# Altium schematic sheet sch.SchDoc
size A4
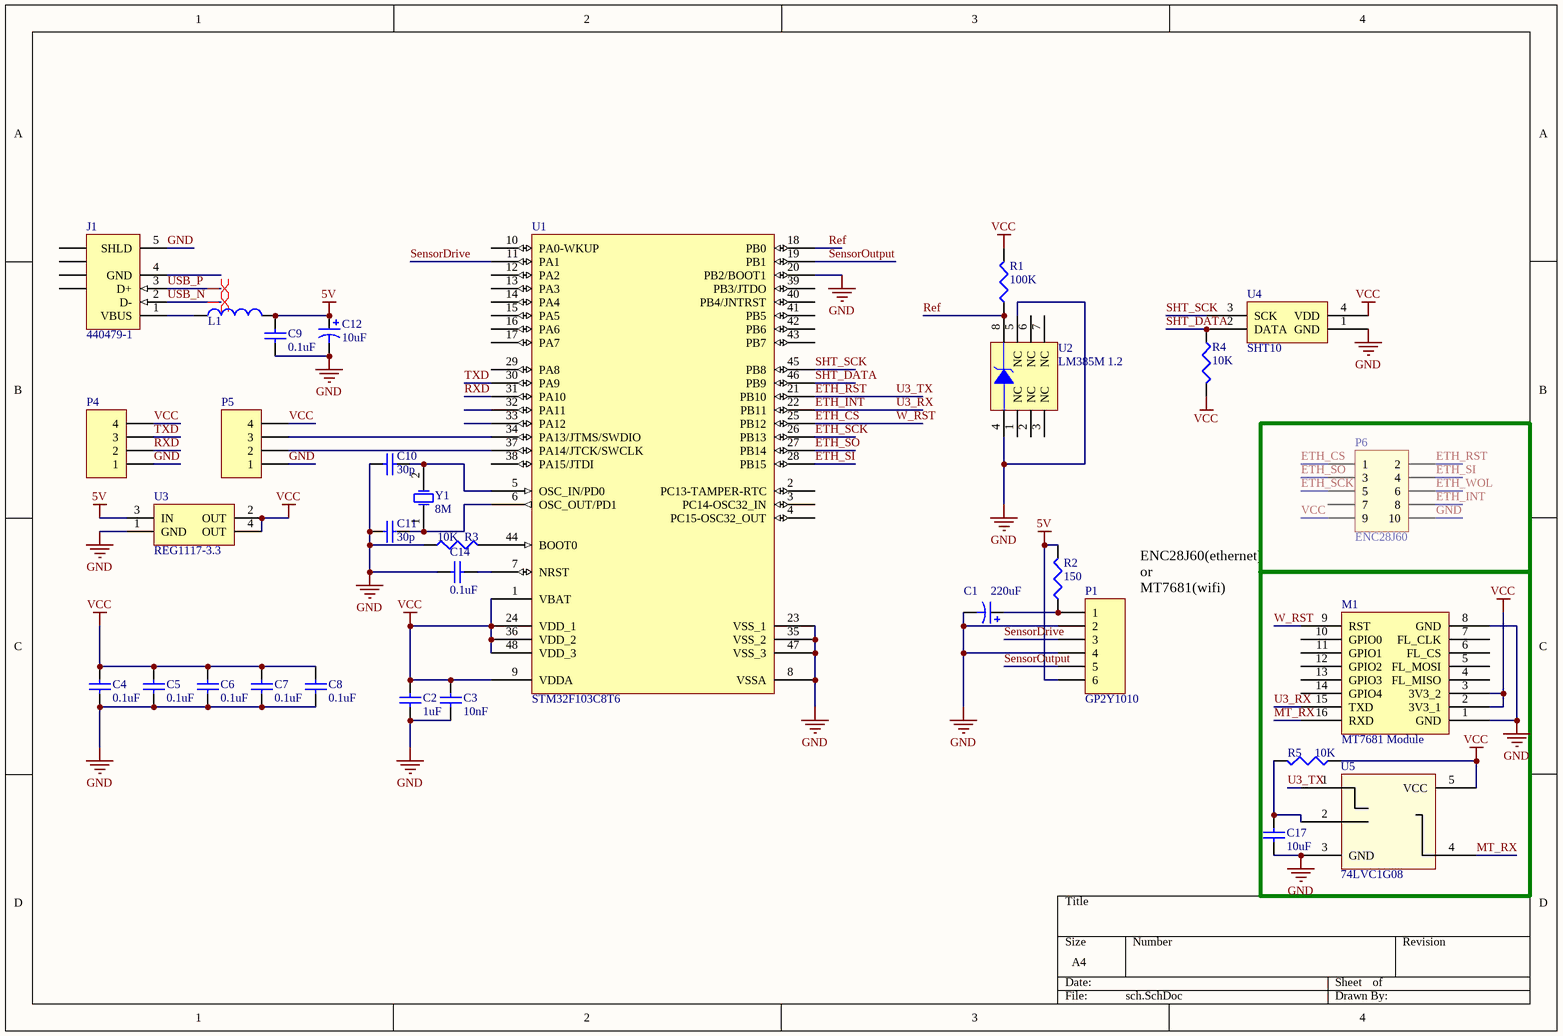
[diagram p0: sch.SchDoc]

## Parts
C1  value 220uF  [B]  (hidden comment: Cap Pol1)
C2  value 1uF  [C1206]  (hidden comment: Cap Semi)
C3  value 10nF  [C1206]  (hidden comment: Cap Semi)
C4  value 0.1uF  [C1206]  (hidden comment: Cap Semi)
C5  value 0.1uF  [C1206]  (hidden comment: Cap Semi)
C6  value 0.1uF  [C1206]  (hidden comment: Cap Semi)
C7  value 0.1uF  [C1206]  (hidden comment: Cap Semi)
C8  value 0.1uF  [C1206]  (hidden comment: Cap Semi)
C9  value 0.1uF  [C1206]  (hidden comment: Cap Semi)
C10  value 30p  [C1206]  (hidden comment: Cap Semi)
C11  value 30p  [C1206]  (hidden comment: Cap Semi)
C12  value 10uF  [1812]  (hidden comment: Cap Pol3)
C14  value 0.1uF  [C1206]  (hidden comment: Cap Semi)
C17  value 10uF  [C1206]  (hidden comment: Cap Semi)
J1  440479-1  [440479]
L1  Inductor  [2012_Chip]  (value not drawn)
M1  MT7681 Module
P1  GP2Y1010  [GP2Y1010AU0F]
P4  Header 4  [HDR1X4]  (value not drawn)
P5  Header 4  [HDR1X4]  (value not drawn)
P6  ENC28J60  [ENC28J60Board]
R1  value 100K  [2012[0805]]  (hidden comment: Res3)
R2  value 150  [2012[0805]]  (hidden comment: Res3)
R3  value 10K  [2012[0805]]  (hidden comment: Res3)
R4  value 10K  [2012[0805]]  (hidden comment: Res3)
R5  value 10K  [2012[0805]]  (hidden comment: Res3)
U1  STM32F103C8T6  [LQFP48_N]
U2  LM385M 1.2  [D008_N]
U3  REG1117-3.3  [ZZ311]
U4  SHT10  [SOIC127P600-8N]
U5  74LVC1G08
Y1  8M  [BCY-W2/E4.7]

## Nets
5V: C9.2 C12.1 L1.2 P1.6 R2.2 U3.3(IN)
GND: C1.2 C2.1 C3.1 C4.1 C5.1 C6.1 C7.1 C8.1 C9.1 C10.2 C11.2 C12.2 C14.2 C17.1 J1.5(SHLD) M1.1(GND) M1.8(GND) P1.2 P1.4 P4.1 P5.1 P6.10 R3.1 U1.8(VSSA) U1.20(PB2/BOOT1) U1.23(VSS_1) U1.35(VSS_2) U1.47(VSS_3) U2.4(A) U2.5(NC) U3.1(GND) U4.1(GND) U5.3(GND)
VCC: C2.2 C3.2 C4.2 C5.2 C6.2 C7.2 C8.2 M1.2(3V3_1) M1.3(3V3_2) P4.4 P5.4 P6.9 R1.2 R4.2 R5.1 U1.1(VBAT) U1.9(VDDA) U1.24(VDD_1) U1.36(VDD_2) U1.48(VDD_3) U3.2(OUT) U3.4(OUT) U4.4(VDD) U5.5(VCC)
ETH_CS: M1.9(RST) P6.1 U1.25(PB12)  [also labelled W_RST]
ETH_INT: M1.15(TXD) P6.8 U1.22(PB11)  [also labelled U3_RX]
ETH_RST: P6.2 U1.21(PB10) U5.1(B)  [also labelled U3_TX]
ETH_SCK: P6.5 U1.26(PB13)
ETH_SI: P6.4 U1.28(PB15)
ETH_SO: P6.3 U1.27(PB14)
ETH_WOL: P6.6
MT_RX: M1.16(RXD) U5.4(Y)
Ref: R1.1 U1.18(PB0) U2.8(K)
RXD: P4.2 U1.31(PA10)
SensorDrive: P1.3 U1.11(PA1)
SensorOutput: P1.5 U1.19(PB1)
SHT_DATA: R4.1 U1.46(PB9) U4.2(DATA)
SHT_SCK: U1.45(PB8) U4.3(SCK)
TXD: P4.3 U1.30(PA9)
USB_N: J1.2(D-)
USB_P: J1.3(D+)
NetC1_1: C1.1 P1.1 R2.1
NetC10_1: C10.1 U1.5(OSC_IN/PD0) Y1.2(OSC2)
NetC11_1: C11.1 U1.6(OSC_OUT/PD1) Y1.1(OSC1)
NetC14_1: C14.1 U1.7(NRST)
NetC17_2: C17.2 R5.2 U5.2(A)
NetJ1_1: J1.1(VBUS) L1.1
NetP5_2: P5.2 U1.37(PA14/JTCK/SWCLK)
NetP5_3: P5.3 U1.34(PA13/JTMS/SWDIO)
NetR3_2: R3.2 U1.44(BOOT0)

Not connected (* = marked no-connect by the designer): J1 4(GND) 6(SHLD) 7(SHLD) 8(SHLD) 9(SHLD); M1 4(FL_MISO) 5(FL_MOSI) 6(FL_CS) 7(FL_CLK) 10(GPIO0) 11(GPIO1) 12(GPIO2) 13(GPIO3) 14(GPIO4); P6 7; U1 2(PC13-TAMPER-RTC) 3(PC14-OSC32_IN) 4(PC15-OSC32_OUT) 10(PA0-WKUP) 12(PA2) 13(PA3) 14(PA4) 15(PA5) 16(PA6) 17(PA7) 29(PA8) 32(PA11) 33(PA12) 38(PA15/JTDI) 39(PB3/JTDO) 40(PB4/JNTRST) 41(PB5) 42(PB6) 43(PB7); U2 1(NC) 2(NC) 3(NC) 6(NC) 7(NC)

## Layout directives
differential pair: USB_N, USB_P

## Notes on the sheet
- ENC28J60(ethernet)
  or
  MT7681(wifi)

## Library data of the parts
C1 = Cap Pol1: Polarized Capacitor (Radial); Published: 8-Jun-2000; LatestRevisionDate: 17-Jul-2002; LatestRevisionNote: Re-released for DXP Platform.; PackageReference: RB7.6-15; Publisher: Altium Limited
C2-C11 C14 C17 = Cap Semi: Capacitor (Semiconductor SIM Model); Published: 8-Jun-2000; LatestRevisionDate: 17-Jul-2002; LatestRevisionNote: Re-released for DXP Platform.; PackageReference: C1206; Publisher: Altium Limited
C12 = Cap Pol3: Polarized Capacitor (Surface Mount); Published: 8-Jun-2000; LatestRevisionDate: 17-Jul-2002; LatestRevisionNote: Re-released for DXP Platform.; PackageReference: C0805; Publisher: Altium Limited
J1 = 440479-1: USB 2.0, Right Angle, SMT, AB Type, Receptacle, 5 Position, Black; ContactMaterial: Phosphor Bronze; ContactPlating: Gold (30) over Nickel; PCB_Layout: Complies with manufacturer's recommendation.; DrillSize: Corresponds to nominal value.; PanelGround: Without; Published: 15-Jul-2004; DatasheetDocument: 28-Jan-2003; PackageDocument: 28-Jan-2003; PackageReference: 440479; Publisher: Altium Limited; HousingMaterial: Thermoplastic; ComponentLink1Description: Manufacturer Link; ComponentLink1URL: http://www.tycoelectronics.com/; ComponentLink2Description: Packaging Specification; ComponentLink2URL: http://ecommas.tycoelectronics.com/commerce/DocumentDelivery/DDEController?Action=showdoc&DocId=Customer+Drawing%7F440479%7FD%7Fpdf%7FEnglish%7FC_440479_D.pdf
L1 = Inductor: Code_IEC: 1005; Value: 10mH; Published: 8-Jun-2000; LatestRevisionDate: 17-Jul-2002; LatestRevisionNote: Re-released for DXP Platform.; PackageReference: 0402-A; Publisher: Altium Limited; Code_JEITA: 0402
M1 = MT7681
P1 = Header 6: Header, 6-Pin; LatestRevisionDate: 17-Jul-2002; LatestRevisionNote: Re-released for DXP Platform.; Publisher: Altium Limited
P4 P5 = Header 4: Header, 4-Pin; LatestRevisionDate: 17-Jul-2002; LatestRevisionNote: Re-released for DXP Platform.; Publisher: Altium Limited
P6 = Header 5X2: Header, 5-Pin, Dual row; LatestRevisionDate: 17-Jul-2002; LatestRevisionNote: Re-released for DXP Platform.; Publisher: Altium Limited
R1-R5 = Res3: Resistor; Published: 8-Jun-2000; LatestRevisionDate: 04-Mar-2005; LatestRevisionNote: PCB Footprint replaced.; PackageReference: J1-0603; Publisher: Altium Limited
U1 = STM32F103C8T6: STM32 ARM-based 32-bit MCU with 64 Kbytes Flash, 48-pin LQFP, Industrial Temperature; Published: 30-May-2008; DatasheetVersion: rev6, Mar-2008; PackageVersion: Mar-2008; PackageReference: LQFP48; Publisher: Altium Limited; PackageDescription: 48-Pin Low-Profile Quad Flat Pack, 7 x 7 mm Body, 0.5 mm Pitch (LQFP48); ComponentLink1Description: Manufacturer Link; ComponentLink1URL: www.st.com/stm32; ComponentLink2Description: Datasheet; ComponentLink2URL: http://www.st.com/stonline/products/literature/ds/13587.pdf
U2 = LM385D-2.5: Micropower Voltage Reference; Published: 15-Apr-2002; LatestRevisionDate: 13-Apr-2006; LatestRevisionNote: IPC-7351 Footprint Added.; DatasheetVersion: Jan-1989; PackageVersion: Jan-1998; PackageReference: D008; Publisher: Altium Limited; PackageDescription: 8-Pin Small Outline Integrated Circuit 1.27 mm Pitch; Code_IPC: SOIC127P600-8; ComponentLink1Description: Manufacturer Link; ComponentLink1URL: http://www.ti.com/
U3 = REG1117-3.3: 800mA and 1A Low Dropout Positive Regulator 2.85V, 3.3V, 5V, and Adjustable; Published: 8-Jun-2000; LatestRevisionDate: 17-Jul-2002; LatestRevisionNote: Re-released for DXP Platform.; DatasheetVersion: Sep-1997; PackageVersion: revC; PackageReference: ZZ311; Publisher: Altium Limited; PackageDescription: SOT-223/SC-73; 4 Leads; Body 6.7 x 7.3 mm, inc. leads (LxW max); ComponentLink1Description: Manufacturer Link; ComponentLink1URL: http://www.ti.com/; ComponentLink2Description: Datasheet; ComponentLink2URL: http://www-s.ti.com/sc/ds/REG1117.pdf
Y1 = XTAL: Crystal Oscillator; Published: 8-Jun-2000; LatestRevisionDate: 17-Jul-2002; LatestRevisionNote: Re-released for DXP Platform.; PackageReference: R38; Publisher: Altium Limited